# EAGLE design Shield (EAGLE 9.6.1)
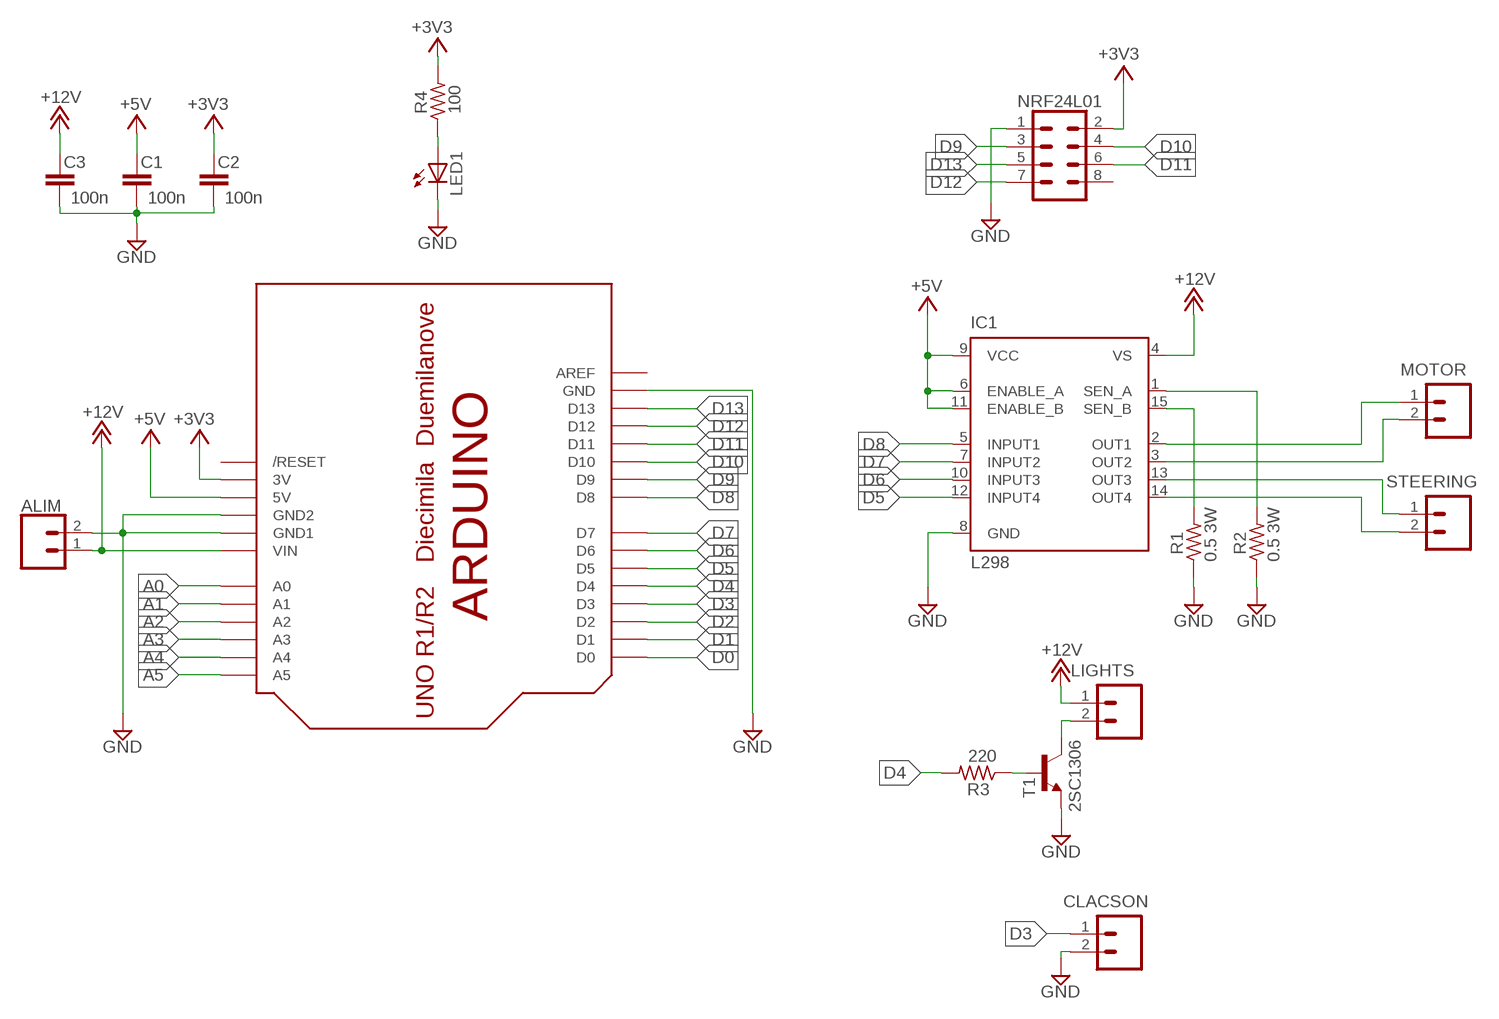
[diagram p0: schematic, sheet 1]

## Parts
ALIM  CONN_025MM  [SCREWTERMINAL-5MM-2]
C1  100n  C5/2.5  [C5B2.5]
C2  100n  C5/2.5  [C5B2.5]
C3  100n  C5/2.5  [C5B2.5]
CLACSON  CONN_025MM  [SCREWTERMINAL-5MM-2]
IC1  L298  [MULTIWATT-15]
LED1  LED5MM  [LED5MM]
LIGHTS  CONN_025MM  [SCREWTERMINAL-5MM-2]
MOTOR  CONN_025MM  [SCREWTERMINAL-5MM-2]
NRF24L01  CONN_04X2  [2X4]
R1  0.5 3W  R-US_0309/12  [0309/12]
R2  0.5 3W  R-US_0309/12  [0309/12]
R3  220  R-US_0309/12  [0309/12]
R4  100  R-US_0309/12  [0309/12]
STEERING  CONN_025MM  [SCREWTERMINAL-5MM-2]
T1  2SC1306  [TO220BV]
U$1  ARDUINO-NOHOLE  [ARDUINO-NOHOLE]

## Nets
+3V3: C2.1 NRF24L01.2 R4.2 U$1.3V
+5V: C1.1 IC1.6(ENABLE_A) IC1.9(VCC) IC1.11(ENABLE_B) U$1.5V
+12V: ALIM.1 C3.1 IC1.4(VS) LIGHTS.1 U$1.VIN
A0: U$1.A0
A1: U$1.A1
A2: U$1.A2
A3: U$1.A3
A4: U$1.A4
A5: U$1.A5
BASE: R3.1 T1.1(B)
COL: LIGHTS.2 T1.2(C)
D0: U$1.D0
D1: U$1.D1
D2: U$1.D2
D3: CLACSON.1 U$1.D3
D4: R3.2 U$1.D4
D5: IC1.12(INPUT4) U$1.D5
D6: IC1.10(INPUT3) U$1.D6
D7: IC1.7(INPUT2) U$1.D7
D8: IC1.5(INPUT1) U$1.D8
D9: NRF24L01.3 U$1.D9
D10: NRF24L01.4 U$1.D10
D11: NRF24L01.6 U$1.D11
D12: NRF24L01.7 U$1.D12
D13: NRF24L01.5 U$1.D13
GND: ALIM.2 C1.2 C2.2 C3.2 CLACSON.2 IC1.8(GND) LED1.K(C) NRF24L01.1 R1.1 R2.1 T1.3(E) U$1.GND U$1.GND1 U$1.GND2
N$1: IC1.15(SEN_B) R1.2
N$2: LED1.A R4.1
N$3: IC1.3(OUT2) MOTOR.2
N$4: IC1.2(OUT1) MOTOR.1
N$5: IC1.13(OUT3) STEERING.1
N$6: IC1.14(OUT4) STEERING.2
N$9: IC1.1(SEN_A) R2.2
Unconnected: NRF24L01.8 U$1.AREF U$1.RESET(/RESET)

## Library data of the parts
ALIM CLACSON LIGHTS MOTOR STEERING = SparkFun-Connectors:CONN_02: Multi connection point. Often used as Generic Header-pin footprint for 0.1 inch spaced/style header connections On any of the 0.1 inch spaced packages, you can populate with these: Break Away Headers - Straight <https://www.sparkfun.com/products/116> (PRT-00116) Break Away Male Headers - Right Angle <https://www.sparkfun.com/products/553> (PRT-00553) Female Headers <https://www.sparkfun.com/products/115> (PRT-00115) Break Away Headers - Machine Pin <https://www.sparkfun.com/products/117> (PRT-00117) Break Away Female Headers - Swiss Machine Pin <https://www.sparkfun.com/products/743> (PRT-00743) For SCREWTERMINALS and SPRING TERMINALS visit here: Screw Terimnals on SparkFun.com <https://www.sparkfun.com/search/results?term=Screw+Terminals> (5mm/3.5mm/2.54mm spacing) This device is also useful as a general connection point to wire up your design to another part of your project. Our various solder wires solder well into these plated through hole pads. Hook-Up Wire - Assortment (Stranded, 22 AWG) <https://www.sparkfun.com/products/11375> (PRT-11375) Hook-Up Wire - Assortment (Solid Core, 22 AWG) <https://www.sparkfun.com/products/11367> (PRT-11367) View the entire wire category on our website here <https://www.sparkfun.com/categories/141> Special notes: Molex polarized connector foot print use with: PRT-08233 with associated crimp pins and housings. 2.54_SCREWTERM for use with PRT-10571. 3.5mm Screw Terminal footprints for PRT-08084 5mm Screw Terminal footprints for use with PRT-08432; SF_SKU: PRT-08432
C1-C3 = capacitor-wima:C: CAPACITOR naming: grid - package width
IC1 = st-microelectronics:L298: DUAL FULL-BRIDGE DRIVER; MPN: L298N; OC_FARNELL: 1589425; OC_NEWARK: 32M1527
LED1 = adafruit:LED: LED OSRAM: - CHIPLED LG R971, LG N971, LY N971, LG Q971, LY Q971, LO R971, LY R971 LH N974, LH R974 LS Q976, LO Q976, LY Q976 LO Q996 - Hyper CHIPLED LW Q18S LB Q993, LB Q99A, LB R99A - SideLED LS A670, LO A670, LY A670, LG A670, LP A670 LB A673, LV A673, LT A673, LW A673 LH A674 LY A675 LS A676, LA A676, LO A676, LY A676, LW A676 LS A679, LY A679, LG A679 - Hyper Micro SIDELED® LS Y876, LA Y876, LO Y876, LY Y876 LT Y87S - SmartLED LW L88C, LW L88S LB L89C, LB L89S, LG L890 LS L89K, LO L89K, LY L89K LS L896, LA L896, LO L896, LY L896 - TOPLED LS T670, LO T670, LY T670, LG T670, LP T670 LSG T670, LSP T670, LSY T670, LOP T670, LYG T670 LG T671, LOG T671, LSG T671 LB T673, LV T673, LT T673, LW T673 LH T674 LS T676, LA T676, LO T676, LY T676, LB T676, LH T676, LSB T676, LW T676 LB T67C, LV T67C, LT T67C, LS T67K, LO T67K, LY T67K, LW E67C LS E67B, LA E67B, LO E67B, LY E67B, LB E67C, LV E67C, LT E67C LW T67C LS T679, LY T679, LG T679 LS T770, LO T770, LY T770, LG T770, LP T770 LB T773, LV T773, LT T773, LW T773 LH T774 LS E675, LA E675, LY E675, LS T675 LS T776, LA T776, LO T776, LY T776, LB T776 LHGB T686 LT T68C, LB T68C - Hyper Mini TOPLED® LB M676 - Mini TOPLED Santana® LG M470 LS M47K, LO M47K, LY M47K Source: http://www.osram.convergy.de/
NRF24L01 = SparkFun-Connectors:CONN_04X2: Multi connection point. Often used as Generic Header-pin footprint for 0.1 inch spaced/style header connections On any of the 0.1 inch spaced packages, you can populate with these: Break Away Headers - Straight <https://www.sparkfun.com/products/116> (PRT-00116) Break Away Male Headers - Right Angle <https://www.sparkfun.com/products/553> (PRT-00553) Female Headers <https://www.sparkfun.com/products/115> (PRT-00115) Break Away Headers - Machine Pin <https://www.sparkfun.com/products/117> (PRT-00117) Break Away Female Headers - Swiss Machine Pin <https://www.sparkfun.com/products/743> (PRT-00743)
R1-R4 = adafruit:R-US_: RESISTOR, American symbol
T1 = transistor:2SC1306: NPN Transistor Final RF Power Outupt Source: 2sc1306.pdf
U$1 = adafruit:ARDUINO: Arduino Diecimila/Duemilanove Make a shield with ease, this package has all the named pins as well as the two mounting drill holes and an outline of the USB and DC power connector. The outline is on the DIMENSION layer, so if your board house uses it they will cut the outline to match. http://www.ladyada.net/library/pcb/eaglelibrary.html

## Board
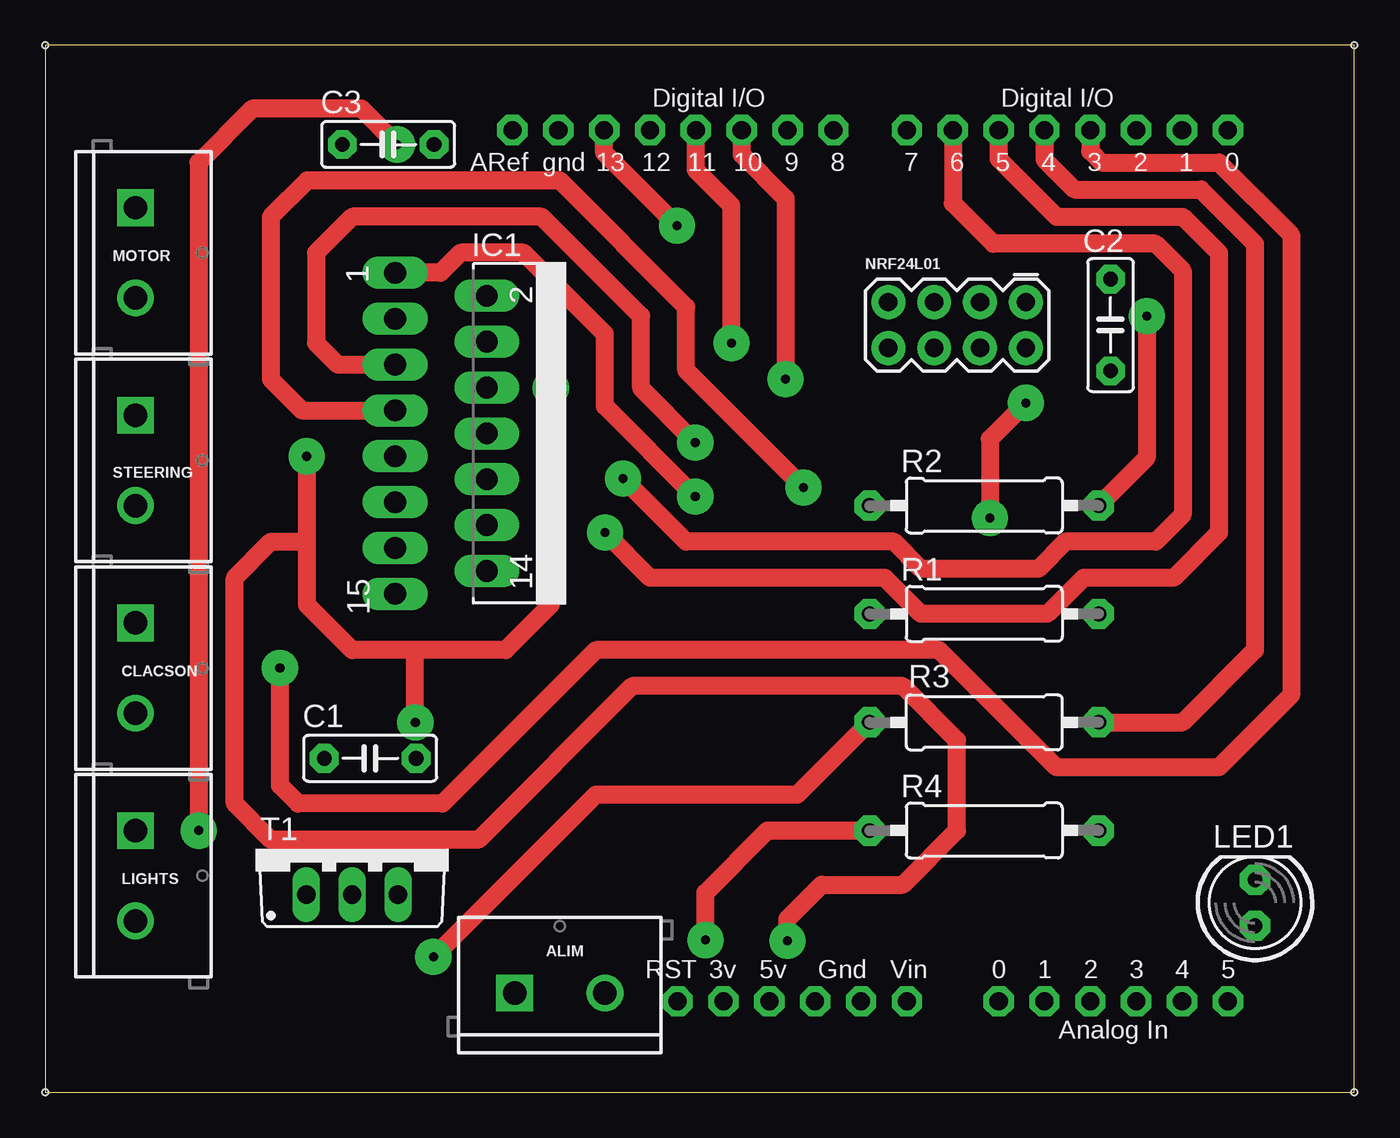
[diagram p1: board, top side]
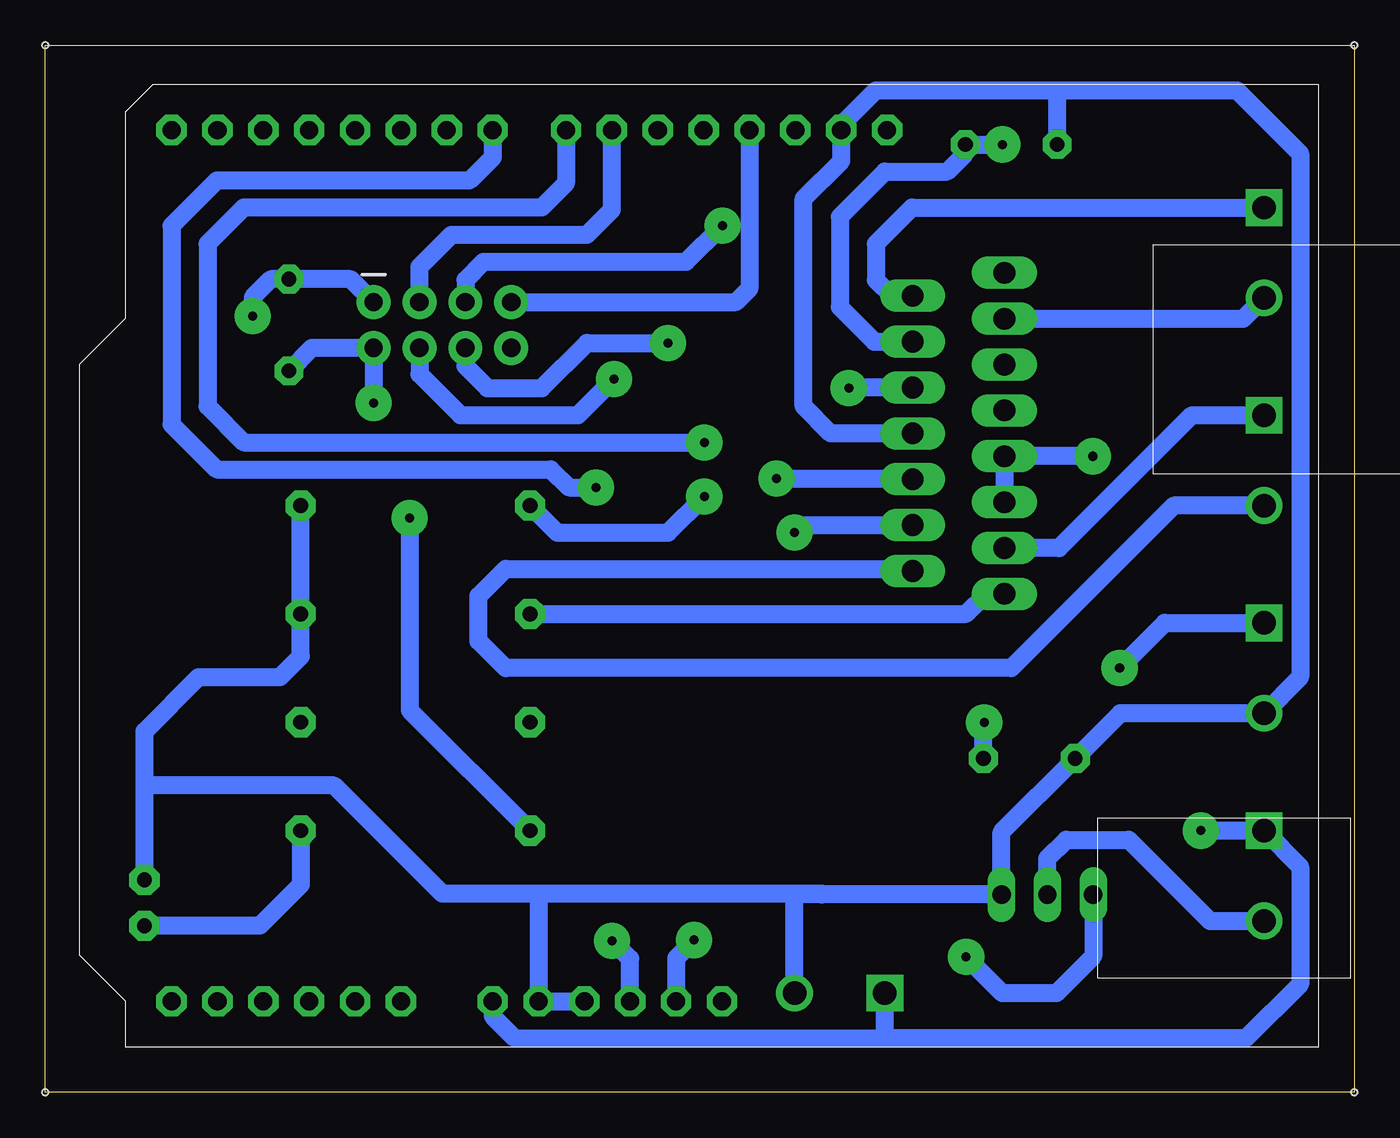
[diagram p2: board, bottom side, seen from below]

Size 72.5 x 58 mm. Coordinates in mm from the lower left corner, seen from the top.
Outline: 0,0 72.5,0 72.5,58 0,58 0,0
Copper layers (1*16): Top 0.035mm / dielectric 1.5mm / Bottom 0.035mm
Design rules "default *": minimum track width 0.5mm, minimum drill 0.5mm, track to track 0.5mm, track to pad 0.5mm, pad to pad 0.5mm, via to via 0.5mm, smd to smd 0.5mm, copper to edge 0.5mm, drill to drill 0.5mm, minimum pad ring 10mil, minimum via ring 8mil, stop-mask expansion 4mil, vias tented up to drill 0mil, thermal gap 10mil
Holes 0.35 mm at 0,0 0,58 72.5,58 72.5,0

### Footprints (pad centres in the part's own frame; a part is rotated, then mirrored left to right if it is on the bottom)
SCREWTERMINAL-5MM-2 = drill 1.3 pad 2.032 square: 1 0,0 | drill 1.3 pad 2.032: 2 5,0
C5B2.5 = drill 0.813 pad 1.6 octagon: 1 -2.54,0; 2 2.54,0
MULTIWATT-15 = drill 1.2 long: 1 -8.89,-7.62; 2 -7.62,-2.54; 3 -6.35,-7.62; 4 -5.08,-2.54; 5 -3.81,-7.62; 6 -2.54,-2.54; 7 -1.27,-7.62; 8 0,-2.54; 9 1.27,-7.62; 10 2.54,-2.54; 11 3.81,-7.62; 12 5.08,-2.54; 13 6.35,-7.62; 14 7.62,-2.54; 15 8.89,-7.62
LED5MM = drill 0.813 pad 1.676 octagon: A -1.27,0; K 1.27,0
2X4 = drill 1.016 pad 1.88: 1 -3.81,-1.27; 2 -3.81,1.27; 3 -1.27,-1.27; 4 -1.27,1.27; 5 1.27,-1.27; 6 1.27,1.27; 7 3.81,-1.27; 8 3.81,1.27
0309/12 = drill 0.813 pad 1.676 octagon: 1 -6.35,0; 2 6.35,0
TO220BV = drill 1.016 long: 1 -2.54,-2.54; 2 0,-2.54; 3 2.54,-2.54
ARDUINO-NOHOLE = drill 1 pad 1.676 octagon: 3V 35.56,2.54; 5V 38.1,2.54; A0 50.8,2.54; A1 53.34,2.54; A2 55.88,2.54; A3 58.42,2.54; A4 60.96,2.54; A5 63.5,2.54; AREF 23.876,50.8; D0 63.5,50.8; D1 60.96,50.8; D2 58.42,50.8; D3 55.88,50.8; D4 53.34,50.8; D5 50.8,50.8; D6 48.26,50.8; D7 45.72,50.8; D8 41.656,50.8; D9 39.116,50.8; D10 36.576,50.8; D11 34.036,50.8; D12 31.496,50.8; D13 28.956,50.8; GND 26.416,50.8; GND1 43.18,2.54; GND2 40.64,2.54; RESET 33.02,2.54; VIN 45.72,2.54

### Placement (x,y rotation side)
ALIM  26,5.5 0 top
C1  18,18.5 180 top
C2  59,42.5 90 top
C3  19,52.5 180 top
CLACSON  5,26 270 top
IC1  27,36.5 270 top
LED1  67,10.5 90 top
LIGHTS  5,14.5 270 top
MOTOR  5,49 270 top
NRF24L01  50.5,42.5 180 top
R1  52,26.5 180 top
R2  52,32.5 180 top
R3  52,20.5 0 top
R4  52,14.5 180 top
STEERING  5,37.5 270 top
T1  17,13.5 0 top
U$1  2,2.5 0 top

### Tracks (layer width: path | path; a pad name or v marks a point on that pad's centre or on a via)
+3V3  (via drill 0.5 pad 2)
  Top 1: 36.5,8.5 v36.56,8.44 36.56,11.06 40,14.5 R4.2 | v54.31,38.19 52.31,36.19 v52.31,31.81
  Bottom 1: C2.1 57.73,41.23 NRF24L01.2 v54.31,38.19 | v52.31,31.81 52.31,21.16 R4.2 | U$1.3V 37.56,7.44 v36.56,8.44
+5V  (via drill 0.5 pad 2)
  Top 1: v28,39 28,27 25.5,24.5 20.5,24.5 | 20.5,24.5 17,24.5 14.5,27 14.5,30.5 | 14.5,30.5 14.5,35.21 v14.48,35.23 | v20.5,20.5 20.5,24.5 | v41.1,8.4 41.1,9.6 43,11.5 47.5,11.5 50.5,14.5 50.5,19.5 47.5,22.5 32.5,22.5 24,14 12.5,14 10.5,16 10.5,28.5 12.5,30.5 14.5,30.5
  Bottom 1: v41.1,8.4 40.1,7.4 U$1.5V | IC1.11 IC1.9 v14.48,35.23 | IC1.6 27.96,39.04 v28,39 | C1.1 20.54,20.46 v20.5,20.5
+12V  (via drill 0.5 pad 2)
  Top 1: v8.5,14.5 8.5,51.5 11.5,54.5 17.5,54.5 v19.5,52.5
  Bottom 1: U$1.VIN 47.72,4.22 46.5,3 26,3 | 26,3 ALIM.1 | IC1.4 26.58,41.58 28.5,43.5 28.5,48.5 26,51 22.54,51 21.54,52 C3.1 v19.5,52.5 | 26,3 6,3 3,6 3,12.5 LIGHTS.1 v8.5,14.5
BASE  (via drill 0.5 pad 2)
  Top 1: v21.5,7.5 30.5,16.5 41.65,16.5 R3.1
  Bottom 1: T1.1 14.46,7.54 16.5,5.5 19.5,5.5 v21.5,7.5
COL
  Bottom 1: T1.2 17,12.96 15.96,14 12.5,14 8,9.5 LIGHTS.2
D3  (via drill 0.5 pad 2)
  Top 1: U$1.D3 57.88,52.12 58.5,51.5 65,51.5 69,47.5 69,22 65,18 56,18 49.5,24.5 30.5,24.5 22,16 14,16 13,17 v13,23.5
  Bottom 1: v13,23.5 10.5,26 CLACSON.1
D4
  Top 1: U$1.D4 55.34,51.66 57,50 64,50 67,47 67,24.5 63,20.5 R3.2
D5  (via drill 0.5 pad 2)
  Top 1: U$1.D5 52.8,51.7 56,48.5 63,48.5 65,46.5 65,31 62.5,28.5 57.5,28.5 55.5,26.5 48.5,26.5 46.5,28.5 33.5,28.5 v31,31
  Bottom 1: v31,31 30.58,31.42 IC1.12
D6  (via drill 0.5 pad 2)
  Top 1: U$1.D6 50.26,49.24 52.5,47 61.5,47 63,45.5 63,32 61.5,30.5 56.5,30.5 55,29 48.5,29 47,30.5 35.5,30.5 v32,34
  Bottom 1: v32,34 24.5,34 IC1.10
D7  (via drill 0.5 pad 2)
  Top 1: IC1.7 14.23,37.77 12.5,39.5 12.5,48.5 14.5,50.5 28.5,50.5 35.5,43.5 35.5,40 v42,33.5
  Bottom 1: U$1.D7 47.72,51.78 49,50.5 63,50.5 65.5,48 65.5,37 63,34.5 44.5,34.5 43.5,33.5 v42,33.5
D8  (via drill 0.5 pad 2)
  Top 1: v36,36 33,39 33,43 27.5,48.5 17,48.5 15,46.5 15,41.5 16.19,40.31 IC1.5
  Bottom 1: U$1.D8 43.66,50.34 45,49 61.5,49 63.5,47 63.5,38 61.5,36 v36,36
D9
  Bottom 1: NRF24L01.3 51.77,45.73 50,47.5 42.5,47.5 41.12,48.88 U$1.D9
D10  (via drill 0.5 pad 2)
  Top 1: v41,39.5 41,49.5 38.58,51.92 U$1.D10
  Bottom 1: NRF24L01.4 51.77,39.77 49.5,37.5 43,37.5 v41,39.5
D11  (via drill 0.5 pad 2)
  Top 1: U$1.D11 36.04,51.09 38,49.12 v38,41.5
  Bottom 1: NRF24L01.6 49.23,40.23 48,39 45,39 42.5,41.5 v38,41.5
D12
  Bottom 1: U$1.D12 33.5,44.5 34.23,43.77 NRF24L01.7
D13  (via drill 0.5 pad 2)
  Top 1: U$1.D13 30.96,52.04 v35,48
  Bottom 1: NRF24L01.5 49.23,45 48.23,46 37,46 v35,48
GND  (via drill 0.5 pad 2)
  Top 1: v61,43 61,35.15 R2.1
  Bottom 1: NRF24L01.1 55.58,45.04 C2.2 60,45.04 61,44.04 v61,43 | 16.46,55.5 26.5,55.5 28.42,53.58 U$1.GND 28.42,51.58 30.5,49.5 30.5,38 29,36.5 IC1.8 | 16.46,55.5 C3.2 | LED1.K 67,17 | R2.1 R1.1 58.35,24.15 59.5,23 64,23 67,20 67,17 | U$1.GND2 U$1.GND1 45.18,11 | ALIM.2 31,10.64 30.91,10.96 29.5,10.96 | 29.5,10.96 29.5,11 45.18,11 | 67,17 56.5,17 50.5,11 45.18,11 | 29.5,10.96 T1.3 19.54,14.42 C1.2 12.96,21 CLACSON.2 3,23 3,52 6.5,55.5 16.46,55.5
N$1
  Bottom 1: R1.2 21.5,26.5 20.39,27.61 IC1.15
N$2
  Bottom 1: R4.1 58.35,11.5 60.62,9.23 LED1.A
N$3
  Bottom 1: IC1.3 6.15,42.85 MOTOR.2
N$4
  Bottom 1: MOTOR.1 24.5,49 26.5,47 26.5,45 25.62,44.12 IC1.2
N$5
  Bottom 1: STEERING.1 9,37.5 16.35,30.15 IC1.13
N$6
  Bottom 1: STEERING.2 10,32.5 19,23.5 47,23.5 48.5,25 48.5,27.5 47,29 24.58,29 IC1.14
N$9  (via drill 0.5 pad 2)
  Top 1: v36,33 31,38 31,42 26.5,46.5 23,46.5 21.89,45.39 IC1.1
  Bottom 1: R2.2 44.15,31 38,31 v36,33